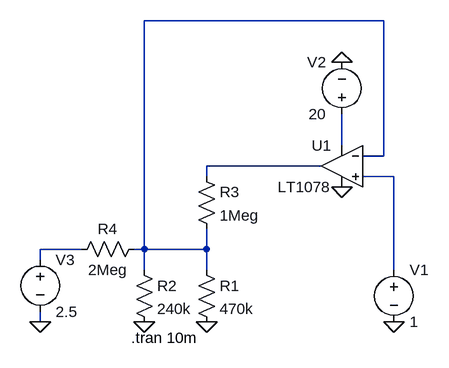
[diagram p0: schematic sim_MPPTY_Output-Voltage.asc]
sim_MPPTY_Output-Voltage.asc, the LTspice schematic file:
Version 4
SHEET 1 880 680
WIRE 288 -224 -80 -224
WIRE 224 -32 224 -80
WIRE 288 -16 288 -224
WIRE 288 -16 256 -16
WIRE 192 0 16 0
WIRE 16 16 16 0
WIRE 304 16 256 16
WIRE -176 128 -240 128
WIRE -80 128 -80 -224
WIRE -80 128 -96 128
WIRE 16 128 16 96
WIRE 16 128 -80 128
WIRE -240 144 -240 128
WIRE -80 160 -80 128
WIRE 16 160 16 128
WIRE 304 160 304 16
WIRE -240 240 -240 224
FLAG 304 240 0
FLAG -80 240 0
FLAG 16 240 0
FLAG 224 -160 0
FLAG 224 32 0
FLAG -240 240 0
SYMBOL voltage 304 144 R0
WINDOW 123 0 0 Left 2
WINDOW 39 0 0 Left 2
SYMATTR InstName V1
SYMATTR Value 1
SYMBOL res 0 144 R0
SYMATTR InstName R1
SYMATTR Value 470k
SYMBOL res -96 144 R0
SYMATTR InstName R2
SYMATTR Value 240k
SYMBOL res 0 0 R0
SYMATTR InstName R3
SYMATTR Value 1Meg
SYMBOL Opamps\\LT1078 224 -64 M0
SYMATTR InstName U1
SYMBOL voltage 224 -64 R180
WINDOW 0 24 96 Left 2
WINDOW 3 24 16 Left 2
WINDOW 123 0 0 Left 2
WINDOW 39 0 0 Left 2
SYMATTR InstName V2
SYMATTR Value 20
SYMBOL res -80 112 R90
WINDOW 0 0 56 VBottom 2
WINDOW 3 32 56 VTop 2
SYMATTR InstName R4
SYMATTR Value 2Meg
SYMBOL voltage -240 128 R0
WINDOW 123 0 0 Left 2
WINDOW 39 0 0 Left 2
SYMATTR InstName V3
SYMATTR Value 2.5
TEXT -100 264 Left 2 !.tran 10m

The netlist it stands for:
* sim_MPPTY_Output-Voltage.asc
V1 N004 0 1
R1 N001 0 470k
R2 N001 0 240k
R3 N003 N001 1Meg
XU1 N004 N001 N002 0 N003 LT1078  ; pins In+ In- V+ V- OUT
V2 N002 0 20
R4 N001 N005 2Meg
V3 N005 0 2.5
.tran 10m
.backanno
.end